# Altium project main_board.PrjPcb
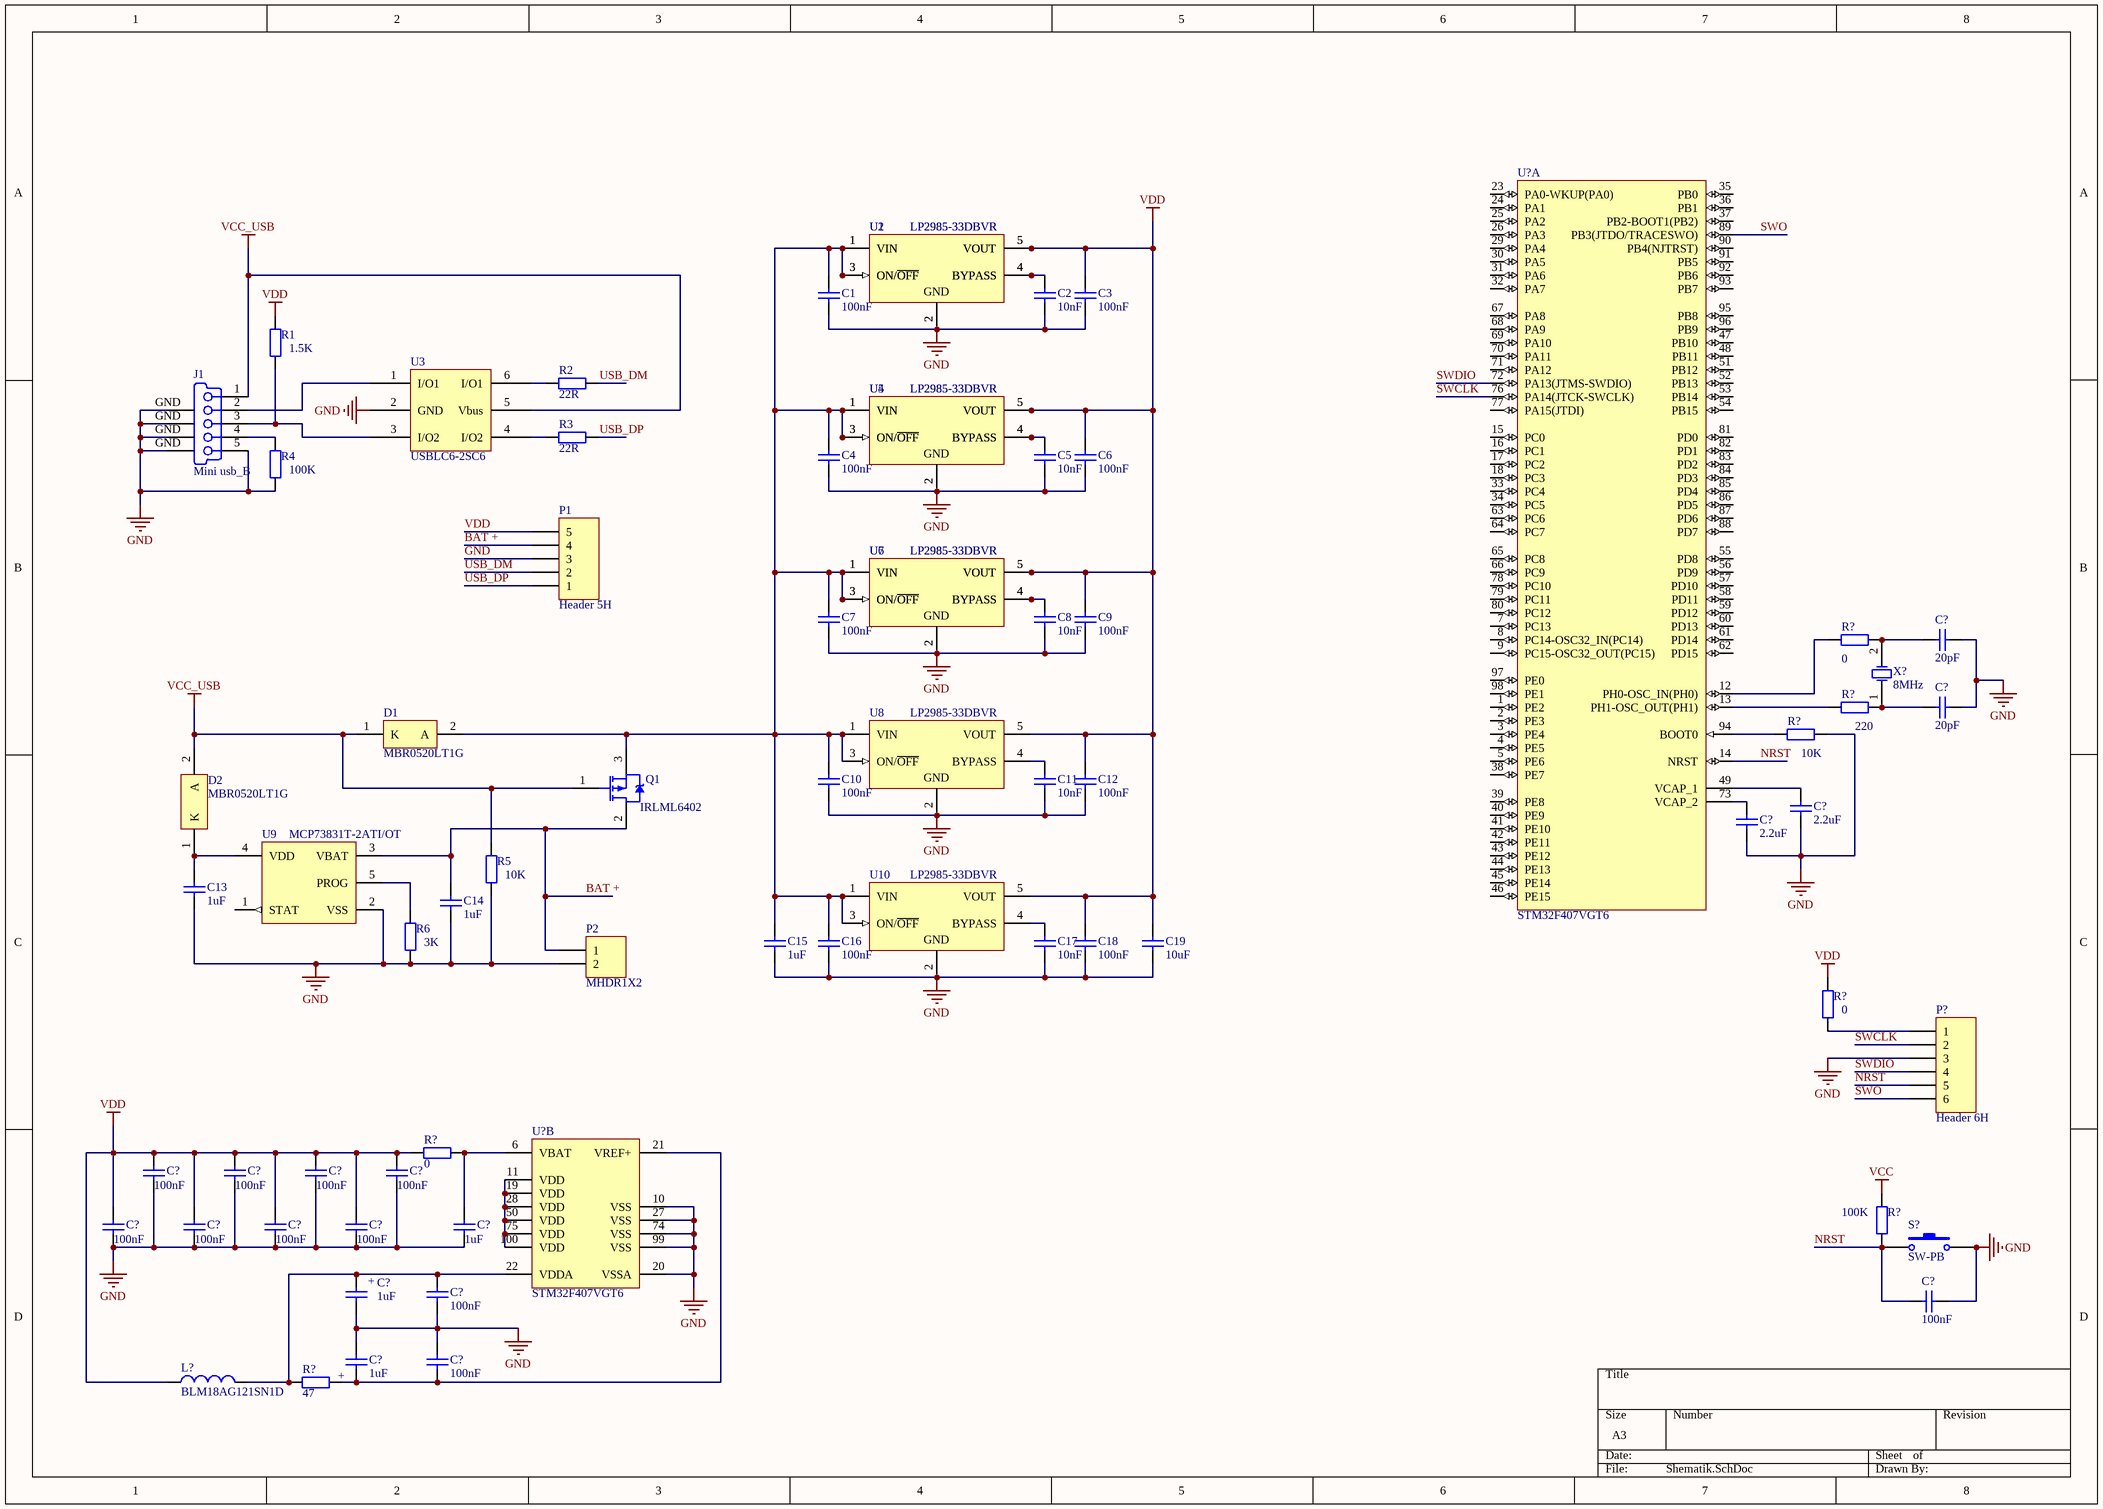
[diagram p0: Shematik.SchDoc]
2 sheets, 117 parts. Net scope: global (net labels, ports and power ports of the same name join across sheets).
Sheets:
  Shematik.SchDoc
  schematic2.SchDoc

## Sheet Shematik.SchDoc
size A3

### Parts
(Parts that share a designator on the sheet are numbered #1, #2 ... from top to bottom, then left to right.)
C1#1  100nF  [C0805]
C2#1  value 10nF  [C0805]  (hidden comment: 100nF)
C3#1  100nF  [C0805]
C4#1  100nF  [C0805]
C5#1  value 10nF  [C0805]  (hidden comment: 100nF)
C6  100nF  [C0805]
C7  100nF  [C0805]
C8  value 10nF  [C0805]  (hidden comment: 100nF)
C9  100nF  [C0805]
C10  100nF  [C0805]
C11  value 10nF  [C0805]  (hidden comment: 100nF)
C12  100nF  [C0805]
C13  1uF  [C0805]
C14  1uF  [C0805]
C15  1uF  [C0805]
C16  100nF  [C0805]
C17  value 10nF  [C0805]  (hidden comment: 100nF)
C18  100nF  [C0805]
C19  10uF  [C0805]
C?#1  value 20pF  [C0805]  (hidden comment: Cap)
C?#2  value 20pF  [C0805]  (hidden comment: Cap)
C?#3  value 2.2uF  [C0805]  (hidden comment: Cap)
C?#4  value 2.2uF  [C0805]  (hidden comment: Cap)
C?#5  value 100nF  [6-0805_M]  (hidden comment: Cap)
C?#6  value 100nF  [6-0805_M]  (hidden comment: Cap)
C?#7  value 100nF  [6-0805_M]  (hidden comment: Cap)
C?#8  value 100nF  [6-0805_M]  (hidden comment: Cap)
C?#9  value 100nF  [6-0805_M]  (hidden comment: Cap)
C?#10  value 100nF  [6-0805_M]  (hidden comment: Cap)
C?#11  value 100nF  [6-0805_M]  (hidden comment: Cap)
C?#12  value 100nF  [6-0805_M]  (hidden comment: Cap)
C?#13  value 1uF  [6-0805_M]  (hidden comment: Cap)
C?#14  value 1uF  [C0805+]  (hidden comment: Cap+)
C?#15  value 100nF  [C0805]  (hidden comment: Cap)
C?#16  value 100nF  [6-0805_M]  (hidden comment: Cap)
C?#17  value 1uF  [C0805+]  (hidden comment: Cap+)
C?#18  value 100nF  [6-0805_M]  (hidden comment: Cap)
D1  MBR0520LT1G  [ONSC-SOD-123-2-425-04_V]
D2  MBR0520LT1G  [ONSC-SOD-123-2-425-04_V]
J1  Mini usb_B  [Mini_USB_B]
L?  BLM18AG121SN1D  [0603]
P1#1  Header 5H  [HDR1X5H]
P2#1  MHDR1X2  [MHDR1X2]
P?  Header 6H  [HDR1X6H]
Q1#1  IRLML6402  [SOT95P237X112-3N]
R1#1  1.5K  [6-0805_N]
R2#1  22R  [6-0805_N]
R3#1  22R  [6-0805_N]
R4#1  100K  [6-0805_N]
R5#1  10K  [6-0805_N]
R6#1  3K  [6-0805_N]
R?#1  0  [6-0805_M]
R?#2  220  [6-0805_M]
R?#3  10K  [6-0805_M]
R?#4  0  [6-0805_M]
R?#5  value 0  [6-0805_N]  (hidden comment: Res2)
R?#6  value 100K  [6-0805_M]  (hidden comment: 100)
R?#7  value 47  [6-0805_N]  (hidden comment: Res2)
S?  SW-PB  [Key_SMD]
U1#1  LP2985-33DBVR  [TI-DBV5_M]
U2#1  LP2985-33DBVR  [TI-DBV5_M]
U3#1  USBLC6-2SC6  [USBLC6-2SC6]
U4#1  LP2985-33DBVR  [TI-DBV5_M]
U5  LP2985-33DBVR  [TI-DBV5_M]
U6  LP2985-33DBVR  [TI-DBV5_M]
U7  LP2985-33DBVR  [TI-DBV5_M]
U8  LP2985-33DBVR  [TI-DBV5_M]
U9  MCP73831T-2ATI/OT  [SOT-23-OT5_M]
U10  LP2985-33DBVR  [TI-DBV5_M]
U?#1  STM32F407VGT6  [STM-LQFP100_N]  (part A of 2)
U?#2  STM32F407VGT6  [STM-LQFP100_N]  (part B of 2)
X?  value 8MHz  [HC49/U3H]  (hidden comment: HC49US8.000MHz)

### Nets
GND: C1#1.1 C2#1.1 C3#1.1 C4#1.1 C5#1.1 C6.1 C7.1 C8.1 C9.1 C10.1 C11.1 C12.1 C13.1 C14.1 C15.1 C16.1 C17.1 C18.1 C19.1 C?#1.2 C?#2.2 C?#3.1 C?#4.1 C?#5.1 C?#6.1 C?#7.1 C?#8.1 C?#9.1 C?#10.1 C?#11.1 C?#12.1 C?#13.1 C?#14.2 C?#15.2 C?#16.1 C?#17.2 C?#18.2 J1.5(GND) J1.GND(Tab) P1#1.3 P2#1.2 P?.3 R4#1.1 R5#1.1 R6#1.1 R?#3.2 S?.2 U1#1.2(GND) U2#1.2(GND) U3#1.2(GND) U4#1.2(GND) U5.2(GND) U6.2(GND) U7.2(GND) U8.2(GND) U9.2(VSS) U10.2(GND) U?#2.10(VSS) U?#2.20(VSSA) U?#2.27(VSS) U?#2.74(VSS) U?#2.99(VSS)
VCC: R?#6.2
VCC_USB: D1.1(K) D2.2(A) J1.1(V_BUS_(5V)) Q1#1.1(G) R5#1.2 U3#1.5(Vbus)
VDD: C3#1.2 C6.2 C9.2 C12.2 C18.2 C19.2 C?#5.2 C?#6.2 C?#7.2 C?#8.2 C?#9.2 C?#10.2 C?#11.2 C?#12.2 L?.1 P1#1.5 R1#1.2 R?#4.2 R?#5.1 U1#1.5(VOUT) U2#1.5(VOUT) U4#1.5(VOUT) U5.5(VOUT) U6.5(VOUT) U7.5(VOUT) U8.5(VOUT) U10.5(VOUT)
BAT +: C14.2 P1#1.4 P2#1.1 Q1#1.2(D) U9.3(VBAT)
NRST: C?#15.1 P?.5 R?#6.1 S?.1 U?#1.14(NRST)
SWCLK: P?.2 U?#1.76(PA14(JTCK-SWCLK))
SWDIO: P?.4 U?#1.72(PA13(JTMS-SWDIO))
SWO: P?.6 U?#1.89(PB3(JTDO/TRACESWO))
USB_DM: P1#1.2 R2#1.2
USB_DP: P1#1.1 R3#1.2
NetC1#1_2: C1#1.2 C4#1.2 C7.2 C10.2 C15.2 C16.2 D1.2(A) Q1#1.3(S) U1#1.1(VIN) U1#1.3(ON/~{OFF}) U2#1.1(VIN) U2#1.3(ON/~{OFF}) U4#1.1(VIN) U4#1.3(ON/~{OFF}) U5.1(VIN) U5.3(ON/~{OFF}) U6.1(VIN) U6.3(ON/~{OFF}) U7.1(VIN) U7.3(ON/~{OFF}) U8.1(VIN) U8.3(ON/~{OFF}) U10.1(VIN) U10.3(ON/~{OFF})
NetC2#1_2: C2#1.2 U1#1.4(BYPASS) U2#1.4(BYPASS)
NetC5#1_2: C5#1.2 U4#1.4(BYPASS) U5.4(BYPASS)
NetC8_2: C8.2 U6.4(BYPASS) U7.4(BYPASS)
NetC11_2: C11.2 U8.4(BYPASS)
NetC13_2: C13.2 D2.1(K) U9.4(VDD)
NetC17_2: C17.2 U10.4(BYPASS)
NetC?#1_1: C?#1.1 R?#1.2 X?.2(OSC2)
NetC?#2_1: C?#2.1 R?#2.2 X?.1(OSC1)
NetC?#3_2: C?#3.2 U?#1.49(VCAP_1)
NetC?#4_2: C?#4.2 U?#1.73(VCAP_2)
NetC?#13_2: C?#13.2 R?#5.2 U?#2.6(VBAT)
NetC?#14_1: C?#14.1 C?#16.2 L?.2 R?#7.1 U?#2.22(VDDA)
NetC?#17_1: C?#17.1 C?#18.1 R?#7.2 U?#2.21(VREF+)
NetJ1_2: J1.2(D-) U3#1.1(I/O1)
NetJ1_3: J1.3(D+) R1#1.1 U3#1.3(I/O2)
NetJ1_4: J1.4(NC) R4#1.2
NetP?_1: P?.1 R?#4.1
NetR2#1_1: R2#1.1 U3#1.6(I/O1)
NetR3#1_1: R3#1.1 U3#1.4(I/O2)
NetR6#1_2: R6#1.2 U9.5(PROG)
NetR?#1_1: R?#1.1 U?#1.12(PH0-OSC_IN(PH0))
NetR?#2_1: R?#2.1 U?#1.13(PH1-OSC_OUT(PH1))
NetR?#3_1: R?#3.1 U?#1.94(BOOT0)
NetU?#2_11: U?#2.11(VDD) U?#2.19(VDD) U?#2.28(VDD) U?#2.50(VDD) U?#2.75(VDD) U?#2.100(VDD)

Not connected (* = marked no-connect by the designer): U9 1(STAT); U?#1 1(PE2) 2(PE3) 3(PE4) 4(PE5) 5(PE6) 7(PC13) 8(PC14-OSC32_IN(PC14)) 9(PC15-OSC32_OUT(PC15)) 15(PC0) 16(PC1) 17(PC2) 18(PC3) 23(PA0-WKUP(PA0)) 24(PA1) 25(PA2) 26(PA3) 29(PA4) 30(PA5) 31(PA6) 32(PA7) 33(PC4) 34(PC5) 35(PB0) 36(PB1) 37(PB2-BOOT1(PB2)) 38(PE7) 39(PE8) 40(PE9) 41(PE10) 42(PE11) 43(PE12) 44(PE13) 45(PE14) 46(PE15) 47(PB10) 48(PB11) 51(PB12) 52(PB13) 53(PB14) 54(PB15) 55(PD8) 56(PD9) 57(PD10) 58(PD11) 59(PD12) 60(PD13) 61(PD14) 62(PD15) 63(PC6) 64(PC7) 65(PC8) 66(PC9) 67(PA8) 68(PA9) 69(PA10) 70(PA11) 71(PA12) 77(PA15(JTDI)) 78(PC10) 79(PC11) 80(PC12) 81(PD0) 82(PD1) 83(PD2) 84(PD3) 85(PD4) 86(PD5) 87(PD6) 88(PD7) 90(PB4(NJTRST)) 91(PB5) 92(PB6) 93(PB7) 95(PB8) 96(PB9) 97(PE0) 98(PE1)

### Notes on the sheet
- (in symbol Cap+) +

### Library data of the parts
C1#1 C2#1 C3#1 C4#1 C5#1 C6-C19 C?#1-C?#13 C?#15 C?#16 C?#18 = Cap: Capacitor; Published: 8-Jun-2000; LatestRevisionDate: 17-Jul-2002; LatestRevisionNote: Re-released for DXP Platform.; PackageReference: RAD-0.3; Publisher: Altium Limited; PackageDescription: Radial Cap, Thru-Hole; 2 Leads; 0.3 in Pin Spacing
  C1#1 C3#1 C4#1 C6 C7 C9 C10 C12 C16 C18: Value: 100nF
  C13-C15: Value: 1uF
  C19: Value: 10uF
C?#14 C?#17 = Cap+: Capacitor; Published: 8-Jun-2000; LatestRevisionDate: 17-Jul-2002; LatestRevisionNote: Re-released for DXP Platform.; PackageReference: RAD-0.3; Publisher: Altium Limited; PackageDescription: Radial Cap, Thru-Hole; 2 Leads; 0.3 in Pin Spacing
D1 D2 = MBR0520LT1G: Schottky Power Rectifier, 2-Pin SOD-123, Pb-Free, Tape and Reel; Manufacturer: On Semiconductor; Configuration: Single; IFSM Max (A): 5.5; DatasheetVersion: Rev. 6; PackageVersion: Rev. G, 10/2009; PackageReference: SOD-123-2-425-04; PackageDescription: 2-Pin SOD, Body 1.6 x 2.69 mm; Supplier 1: Farnell; Supplier Part Number 1: 9556915; Supplier 2: Farnell; Supplier Part Number 2: 9556915RL; Supplier 3: Farnell; Supplier Part Number 3: 2317669; Supplier 4: Farnell; Supplier Part Number 4: 1562304; Supplier 5: Newark; Supplier Part Number 5: 48K7498; Supplier 6: Newark; Supplier Part Number 6: 83H7278; Supplier 7: Newark; Supplier Part Number 7: 28X7856; Supplier 8: Mouser; Supplier Part Number 8: 863-MBR0520LT1G; Packing: Tape and Reel; RoHS: TRUE; Mounting Technology: Surface Mount; PartNumber: MBR0520LT1G; ComponentLink1Description: Manufacturer URL; ComponentLink1URL: http://www.onsemi.com/; ComponentLink2Description: Datasheet; ComponentLink2URL: http://www.onsemi.cn/pub_link/Collateral/MBR0520LT1-D.PDF; ComponentLink3Description: Package Specification; ComponentLink3URL: http://www.onsemi.com/pub_link/Collateral/425-04.PDF
J1 = Mini usb_B: PCB_Layout: Complies with Manufacturer's Recommendation.; Published: 21-Sep-2007; DatasheetVersion: revA, May-2004; PackageVersion: May-2004; PackageReference: 481900001; Publisher: Altium Limited; PackageDescription: USB Mini-B, Sinking Type, SM; 5 Position; Right Angle, Body 11.45 x 11.8 x 3.9 mm (LxWxH); ComponentLink1Description: Manufacturer Link; ComponentLink1URL: http://www.molex.com/; ComponentLink2Description: Datasheet; ComponentLink2URL: http://www.molex.com/cmc_upload/0/000/895/958/SD-48190-001RevA.pdf
L? = Inductor: Code_IEC: 1005; Value: 10mH; Published: 8-Jun-2000; LatestRevisionDate: 29-May-2009; LatestRevisionNote: IPC-7351 Footprint Added.; PackageReference: 0402-A; Publisher: Altium Limited; PackageDescription: Chip Inductor; Code_JEITA: 0402
P1#1 = Header 5H: Header, 5-Pin, Right Angle; LatestRevisionDate: 17-Jul-2002; LatestRevisionNote: Re-released for DXP Platform.; Publisher: Altium Limited
P2#1 = MHDR1X2: Header, 2-Pin; LatestRevisionDate: 17-Jul-2002; LatestRevisionNote: Re-released for DXP Platform.; Publisher: Altium Limited
P? = Header 6H: Header, 6-Pin, Right Angle; LatestRevisionDate: 17-Jul-2002; LatestRevisionNote: Re-released for DXP Platform.; Publisher: Altium Limited
R1#1 R2#1 R3#1 R4#1 R5#1 R6#1 R?#1-R?#7 = Res2: Resistor; Published: 8-Jun-2000; LatestRevisionDate: 17-Jul-2002; LatestRevisionNote: Re-released for DXP Platform.; PackageReference: AXIAL-0.4; Publisher: Altium Limited; PackageDescription: Axial Device, Thru-Hole; 2 Leads; 0.4 in Pin Spacing
  R1#1: Value: 1.5K
  R2#1 R3#1: Value: 22R
  R4#1: Value: 100K
  R5#1 R?#3: Value: 10K
  R6#1: Value: 3K
  R?#1 R?#4: Value: 0
  R?#2: Value: 220
S? = SW-PB: Switch; Published: 24-Mar-1999; LatestRevisionDate: 17-Jul-2002; LatestRevisionNote: Re-released for DXP Platform.; PackageReference: SPST-2; Publisher: Altium Limited; PackageDescription: Switch; 2 Leads
U1#1 U2#1 U4#1 U5-U8 U10 = LP2985-33DBVR: Single Output Low Noise LDO, 150 mA, Fixed 3.3 V Output, 2.2 to 16 V Input, with Low IQ, 5-pin SOT-23 (DBV), -40 to 125 degC, Green (RoHS & no Sb/Br); Manufacturer: Texas Instruments; Accuracy(%): 1.5; Fixed Output Options(V): 10; Iout(Max)(A): 0.15; Iq(Typ)(mA): 0.85; SubFamily: Single Channel LDO; Vdo(Typ)(mV): 280; Vin(Max)(V): 16; Vin(Min)(V): 2.2; Vout Adj(Max)(V): 3.3; DatasheetVersion: SLVS522N; PackageVersion: 4073253-4/K; PackageReference: DBV5; PackageDescription: 5-Pin Plastic Small Outline, Body 1.60 Г— 2.90 mm, Pitch 0.95 mm; Supplier 1: Digi-Key; Supplier Part Number 1: 296-24263-1-ND; Supplier 2: Digi-Key; Supplier Part Number 2: 296-24263-6-ND; Supplier 3: Newark; Supplier Part Number 3: 24R9588; Supplier 4: Mouser; Supplier Part Number 4: 595-LP2985-33DBVR; Eco-Plan: Green (RoHS & no Sb/Br); Vout Adj(Min)(V): 3.3; Mounting Technology: Surface Mount; Code_JEDEC: MO-178; PartNumber: LP2985-33DBVR; ComponentLink1Description: Manufacturer URL; ComponentLink1URL: http://www.ti.com/; ComponentLink2Description: Datasheet; ComponentLink2URL: http://www.ti.com/general/docs/lit/getliterature.tsp?genericPartNumber=LP2985-10&fileType=pdf; ComponentLink3Description: Package Specification; ComponentLink3URL: http://www.ti.com/litv/pdf/mpds018i
U9 = MCP73831T-2ATI/OT: Miniature Single-Cell, Fully Integrated Li-Ion, Li-Polymer Charge Management Controller, 4.2V, 5-Pin SOT-23, Industrial Temperature, Tape and Reel; Manufacturer: Microchip; DatasheetVersion: revE, Sep-2008; PackageVersion: revBB, Aug-2009; PackageReference: SOT-23-OT5; PackageDescription: 5-Lead Plastic Small Outline Transistor (OT) [SOT-23]; Supplier 1: Digi-Key; Supplier Part Number 1: MCP73831T-2ATI/OTTR-ND; Supplier 2: Digi-Key; Supplier Part Number 2: MCP73831T-2ATI/OTCT-ND; Supplier 3: Digi-Key; Supplier Part Number 3: MCP73831T-2ATI/OTDKR-ND; Supplier 4: Farnell; Supplier Part Number 4: 1834890RL; Supplier 5: Farnell; Supplier Part Number 5: 1834890; Supplier 6: Newark; Supplier Part Number 6: 84R5196; Supplier 7: Mouser; Supplier Part Number 7: 579-MCP73831T-2ATIOT; Mounting Technology: Surface Mount; Code_IPC: SOT23-5; PartNumber: MCP73831T-2ATI/OT; ComponentLink1Description: Manufacturer URL; ComponentLink1URL: http://www.microchip.com/; ComponentLink2Description: Datasheet; ComponentLink2URL: http://ww1.microchip.com/downloads/en/DeviceDoc/21984e.pdf; ComponentLink3Description: Package Specification; ComponentLink3URL: http://www.microchip.com/stellent/groups/techpub_sg/documents/packagingspec/en012702.pdf
U?#1 U?#2 = STM32F407VGT6: ARM Cortex-M4 32-bit MCU+FPU, 210 DMIPS, 1024 kB Flash, 192 kB Internal RAM, 82 I/Os, 100-pin LQFP, -40 to 85 degC, Tray; Manufacturer: STMicroelectronics; D/A Converter: 2x12-bit; FLASH Size (Prog) (kB): 1024; I/Os (High Current): 82; Internal RAM Size (kB): 192; Operating Frequency(F) (Processor speed) (MHz): 168; Supply Voltage(Vcc) max (V): 3.6; Supply Voltage(Vcc) min (V): 1.8; DatasheetVersion: Rev. 4; PackageVersion: Rev. 1, 06/2013; PackageReference: LQFP100; PackageDescription: 100-Pin Low Profile Quad Flat Package, 14 x 14 mm Body, 0.5 mm Pitch; Supplier 1: Digi-Key; Supplier Part Number 1: 497-11605-ND; Supplier 2: Farnell; Supplier Part Number 2: 2064368; Supplier 3: Newark; Supplier Part Number 3: 73T2333; Supplier 4: Mouser; Supplier Part Number 4: 511-STM32F407VGT6; Core: ARM Cortex-M4; Packing: Tray; Mounting Technology: Surface Mount; PartNumber: STM32F407VGT6; ComponentLink1Description: Manufacturer URL; ComponentLink1URL: http://www.st.com/web/en/home.html; ComponentLink2Description: Datasheet; ComponentLink2URL: http://www.st.com/st-web-ui/static/active/en/resource/technical/document/datasheet/DM00037051.pdf; ComponentLink3Description: Package Specification; ComponentLink3URL: http://www.st.com/st-web-ui/static/active/en/resource/technical/document/data_brief/DM00071938.pdf
X? = XTAL: Crystal Oscillator; Published: 8-Jun-2000; LatestRevisionDate: 17-Jul-2002; LatestRevisionNote: Re-released for DXP Platform.; PackageReference: R38; Publisher: Altium Limited; PackageDescription: Crystal, Thru-Hole; 2 Leads; Body 3.1 x 8.2 mm (Dia.xH)

## Sheet schematic2.SchDoc
size A3
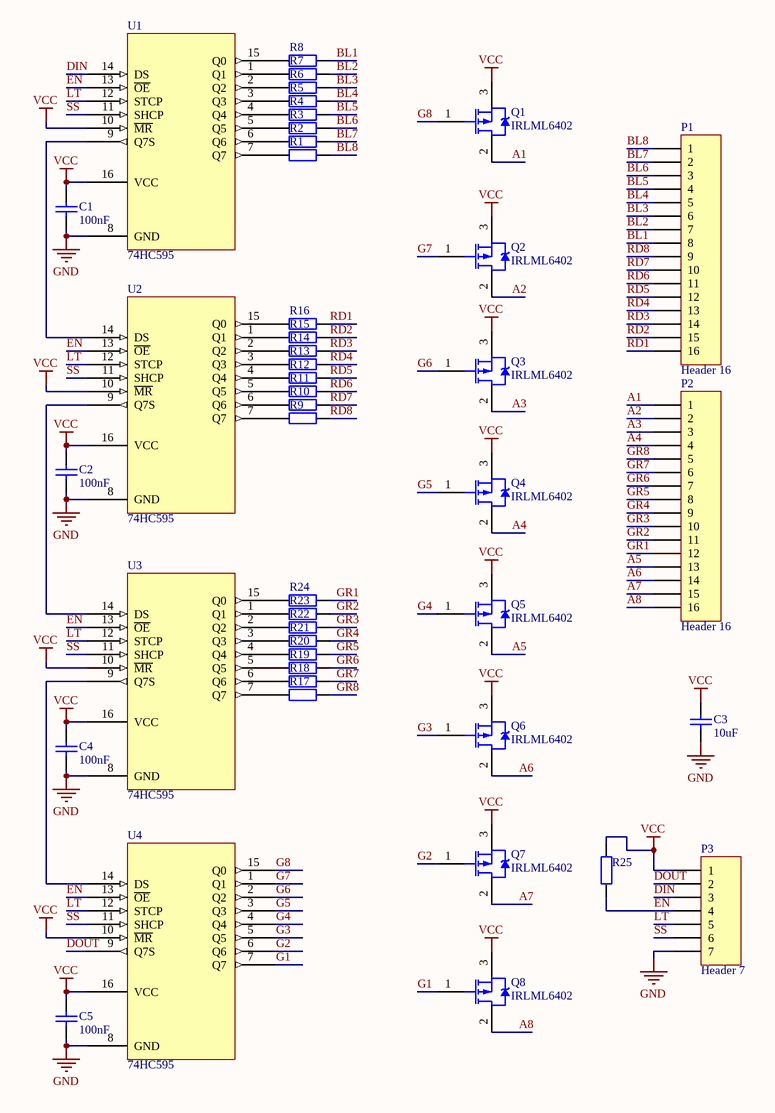
[diagram p1: schematic2.SchDoc]

### Parts
(Parts that share a designator on the sheet are numbered #1, #2 ... from top to bottom, then left to right.)
C1#2  value 100nF  [6-0805_M]  (hidden comment: Cap)
C2#2  value 100nF  [6-0805_M]  (hidden comment: Cap)
C3#2  value 10uF  [6-0805_M]  (hidden comment: Cap)
C4#2  value 100nF  [6-0805_M]  (hidden comment: Cap)
C5#2  value 100nF  [6-0805_M]  (hidden comment: Cap)
P1#2  Header 16  [HDR1X16]
P2#2  Header 16  [HDR1X16]
P3  Header 7  [HDR1X7]
Q1#2  IRLML6402  [SOT95P237X112-3N]
Q2  IRLML6402  [SOT95P237X112-3N]
Q3  IRLML6402  [SOT95P237X112-3N]
Q4  IRLML6402  [SOT95P237X112-3N]
Q5  IRLML6402  [SOT95P237X112-3N]
Q6  IRLML6402  [SOT95P237X112-3N]
Q7  IRLML6402  [SOT95P237X112-3N]
Q8  IRLML6402  [SOT95P237X112-3N]
R1#2  Res2  [6-0805_M]  (value not drawn)
R2#2  Res2  [6-0805_M]  (value not drawn)
R3#2  Res2  [6-0805_M]  (value not drawn)
R4#2  Res2  [6-0805_M]  (value not drawn)
R5#2  Res2  [6-0805_M]  (value not drawn)
R6#2  Res2  [6-0805_M]  (value not drawn)
R7  Res2  [6-0805_M]  (value not drawn)
R8  Res2  [6-0805_M]  (value not drawn)
R9  Res2  [6-0805_M]  (value not drawn)
R10  Res2  [6-0805_M]  (value not drawn)
R11  Res2  [6-0805_M]  (value not drawn)
R12  Res2  [6-0805_M]  (value not drawn)
R13  Res2  [6-0805_M]  (value not drawn)
R14  Res2  [6-0805_M]  (value not drawn)
R15  Res2  [6-0805_M]  (value not drawn)
R16  Res2  [6-0805_M]  (value not drawn)
R17  Res2  [6-0805_M]  (value not drawn)
R18  Res2  [6-0805_M]  (value not drawn)
R19  Res2  [6-0805_M]  (value not drawn)
R20  Res2  [6-0805_M]  (value not drawn)
R21  Res2  [6-0805_M]  (value not drawn)
R22  Res2  [6-0805_M]  (value not drawn)
R23  Res2  [6-0805_M]  (value not drawn)
R24  Res2  [6-0805_M]  (value not drawn)
R25  Res2  [6-0805_M]  (value not drawn)
U1#2  74HC595  [TSOP65P640X110-16M]
U2#2  74HC595  [TSOP65P640X110-16M]
U3#2  74HC595  [TSOP65P640X110-16M]
U4#2  74HC595  [TSOP65P640X110-16M]

### Nets
GND: C1#2.1 C2#2.1 C3#2.1 C4#2.1 C5#2.1 P3.7 U1#2.8(GND) U2#2.8(GND) U3#2.8(GND) U4#2.8(GND)
VCC: C1#2.2 C2#2.2 C3#2.2 C4#2.2 C5#2.2 P3.1 Q1#2.3(S) Q2.3(S) Q3.3(S) Q4.3(S) Q5.3(S) Q6.3(S) Q7.3(S) Q8.3(S) R25.2 U1#2.10(~{MR}) U1#2.16(VCC) U2#2.10(~{MR}) U2#2.16(VCC) U3#2.10(~{MR}) U3#2.16(VCC) U4#2.10(~{MR}) U4#2.16(VCC)
A1: P2#2.1 Q1#2.2(D)
A2: P2#2.2 Q2.2(D)
A3: P2#2.3 Q3.2(D)
A4: P2#2.4 Q4.2(D)
A5: P2#2.13 Q5.2(D)
A6: P2#2.14 Q6.2(D)
A7: P2#2.15 Q7.2(D)
A8: P2#2.16 Q8.2(D)
BL1: P1#2.8 R8.2
BL2: P1#2.7 R7.2
BL3: P1#2.6 R6#2.2
BL4: P1#2.5 R5#2.2
BL5: P1#2.4 R4#2.2
BL6: P1#2.3 R3#2.2
BL7: P1#2.2 R2#2.2
BL8: P1#2.1 R1#2.2
DIN: P3.3 U1#2.14(DS)
DOUT: P3.2 U4#2.9(Q7S)
EN: P3.4 R25.1 U1#2.13(~{OE}) U2#2.13(~{OE}) U3#2.13(~{OE}) U4#2.13(~{OE})
G1: Q8.1(G) U4#2.7(Q7)
G2: Q7.1(G) U4#2.6(Q6)
G3: Q6.1(G) U4#2.5(Q5)
G4: Q5.1(G) U4#2.4(Q4)
G5: Q4.1(G) U4#2.3(Q3)
G6: Q3.1(G) U4#2.2(Q2)
G7: Q2.1(G) U4#2.1(Q1)
G8: Q1#2.1(G) U4#2.15(Q0)
GR1: P2#2.12 R24.2
GR2: P2#2.11 R23.2
GR3: P2#2.10 R22.2
GR4: P2#2.9 R21.2
GR5: P2#2.8 R20.2
GR6: P2#2.7 R19.2
GR7: P2#2.6 R18.2
GR8: P2#2.5 R17.2
LT: P3.5 U1#2.12(STCP) U2#2.12(STCP) U3#2.12(STCP) U4#2.12(STCP)
RD1: P1#2.16 R16.2
RD2: P1#2.15 R15.2
RD3: P1#2.14 R14.2
RD4: P1#2.13 R13.2
RD5: P1#2.12 R12.2
RD6: P1#2.11 R11.2
RD7: P1#2.10 R10.2
RD8: P1#2.9 R9.2
SS: P3.6 U1#2.11(SHCP) U2#2.11(SHCP) U3#2.11(SHCP) U4#2.11(SHCP)
NetR1#2_1: R1#2.1 U1#2.7(Q7)
NetR2#2_1: R2#2.1 U1#2.6(Q6)
NetR3#2_1: R3#2.1 U1#2.5(Q5)
NetR4#2_1: R4#2.1 U1#2.4(Q4)
NetR5#2_1: R5#2.1 U1#2.3(Q3)
NetR6#2_1: R6#2.1 U1#2.2(Q2)
NetR7_1: R7.1 U1#2.1(Q1)
NetR8_1: R8.1 U1#2.15(Q0)
NetR9_1: R9.1 U2#2.7(Q7)
NetR10_1: R10.1 U2#2.6(Q6)
NetR11_1: R11.1 U2#2.5(Q5)
NetR12_1: R12.1 U2#2.4(Q4)
NetR13_1: R13.1 U2#2.3(Q3)
NetR14_1: R14.1 U2#2.2(Q2)
NetR15_1: R15.1 U2#2.1(Q1)
NetR16_1: R16.1 U2#2.15(Q0)
NetR17_1: R17.1 U3#2.7(Q7)
NetR18_1: R18.1 U3#2.6(Q6)
NetR19_1: R19.1 U3#2.5(Q5)
NetR20_1: R20.1 U3#2.4(Q4)
NetR21_1: R21.1 U3#2.3(Q3)
NetR22_1: R22.1 U3#2.2(Q2)
NetR23_1: R23.1 U3#2.1(Q1)
NetR24_1: R24.1 U3#2.15(Q0)
NetU1#2_9: U1#2.9(Q7S) U2#2.14(DS)
NetU2#2_9: U2#2.9(Q7S) U3#2.14(DS)
NetU3#2_9: U3#2.9(Q7S) U4#2.14(DS)

### Library data of the parts
C1#2 C2#2 C3#2 C4#2 C5#2 = Cap: Capacitor; Published: 8-Jun-2000; LatestRevisionDate: 17-Jul-2002; LatestRevisionNote: Re-released for DXP Platform.; PackageReference: RAD-0.3; Publisher: Altium Limited; PackageDescription: Radial Cap, Thru-Hole; 2 Leads; 0.3 in Pin Spacing
P1#2 P2#2 = Header 16: Header, 16-Pin; LatestRevisionDate: 17-Jul-2002; LatestRevisionNote: Re-released for DXP Platform.; Publisher: Altium Limited
P3 = Header 7: Header, 7-Pin; LatestRevisionDate: 17-Jul-2002; LatestRevisionNote: Re-released for DXP Platform.; Publisher: Altium Limited
R1#2 R2#2 R3#2 R4#2 R5#2 R6#2 R7 R8 R17-R24 = Res2: Resistor; Value: 20; Published: 8-Jun-2000; LatestRevisionDate: 17-Jul-2002; LatestRevisionNote: Re-released for DXP Platform.; PackageReference: AXIAL-0.4; Publisher: Altium Limited; PackageDescription: Axial Device, Thru-Hole; 2 Leads; 0.4 in Pin Spacing
R9-R16 = Res2: Resistor; Value: 91; Published: 8-Jun-2000; LatestRevisionDate: 17-Jul-2002; LatestRevisionNote: Re-released for DXP Platform.; PackageReference: AXIAL-0.4; Publisher: Altium Limited; PackageDescription: Axial Device, Thru-Hole; 2 Leads; 0.4 in Pin Spacing
R25 = Res2: Resistor; Value: 10kOm; Published: 8-Jun-2000; LatestRevisionDate: 17-Jul-2002; LatestRevisionNote: Re-released for DXP Platform.; PackageReference: AXIAL-0.4; Publisher: Altium Limited; PackageDescription: Axial Device, Thru-Hole; 2 Leads; 0.4 in Pin Spacing
U1#2 U2#2 U3#2 U4#2 = 74HC595: NXP

## Nets that join several sheets
GND: Shematik (62 pins), schematic2 (10 pins)
VCC: Shematik (R?#6.2), schematic2 (23 pins)